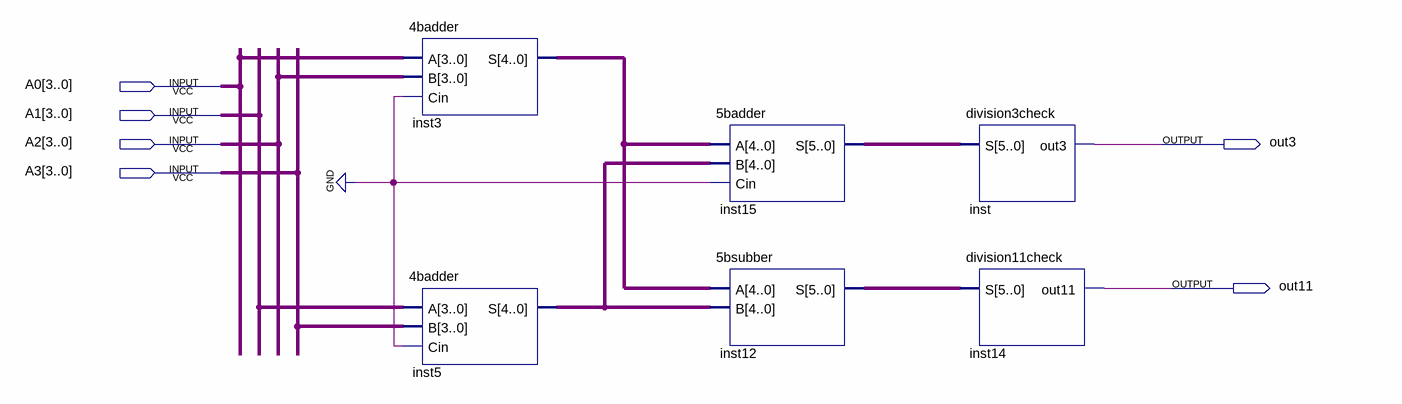
[diagram p0: schematic sheet]
// Quartus schematic main1.bdf as structural Verilog: 6 symbols, 6 pins
module main1 (
  input  [3:0] A0,
  input  [3:0] A1,
  input  [3:0] A2,
  input  [3:0] A3,
  output out3,
  output out11
);

  wire [4:0] inst3_s, inst5_s;
  wire [5:0] inst12_s, inst15_s;

  \4badder  inst3 (.A(A0), .B(A2), .Cin(1'b0), .S(inst3_s));
  \4badder  inst5 (.A(A1), .B(A3), .Cin(1'b0), .S(inst5_s));
  \5badder  inst15 (.A(inst3_s), .B(inst5_s), .Cin(1'b0), .S(inst15_s));
  \5bsubber  inst12 (.A(inst3_s), .B(inst5_s), .S(inst12_s));
  division3check inst (.S(inst15_s), .out3(out3));
  division11check inst14 (.S(inst12_s), .out11(out11));
endmodule
